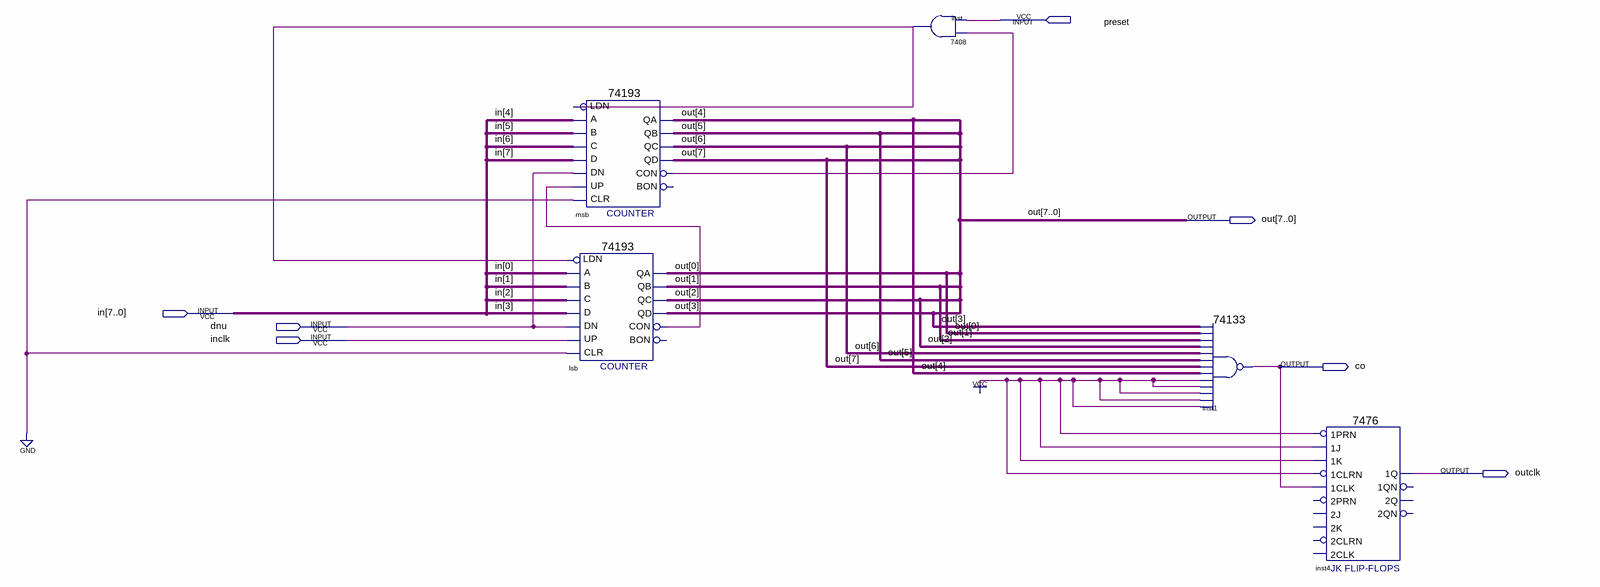
[diagram p0: schematic sheet]
// Quartus schematic FrequencyDivider.bdf as structural Verilog: 5 symbols, 7 pins
module FrequencyDivider (
  input  preset,
  input  [7:0] in,
  input  dnu,
  input  inclk,
  output [7:0] out,
  output co,
  output outclk
);

  wire inst_1, lsb_con, msb_con;

  \74193  msb (
    .D(in[7]), .C(in[6]), .B(in[5]), .A(in[4]), .CLR(1'b0), .UP(lsb_con), .DN(dnu), .LDN(inst_1),
    .QB(out[5]), .QA(out[4]), .CON(msb_con), .QD(out[7]), .QC(out[6]));  // open: BON
  \74193  lsb (
    .D(in[3]), .C(in[2]), .B(in[1]), .A(in[0]), .CLR(1'b0), .UP(inclk), .DN(dnu), .LDN(inst_1), .QB(out[1]),
    .QA(out[0]), .CON(lsb_con), .QD(out[3]), .QC(out[2]));  // open: BON
  \7408  inst (.\3 (preset), .\2 (msb_con), .\1 (inst_1));
  \74133  inst1 (
    .\13 (1'b1), .\12 (1'b1), .\11 (1'b1), .\10 (1'b1), .\9 (out[4]), .\7 (out[5]), .\8 (out[7]),
    .\6 (out[6]), .\2 (out[3]), .\3 (out[0]), .\14 (1'b1), .\5 (out[2]), .\4 (out[1]), .\1 (co));
  \7476  inst4 (
    .\1J (1'b1), .\1K (1'b1), .\1PRN (1'b1), .\1CLK (co), .\1CLRN (1'b1), .\1Q (outclk));  // open: 2PRN, 2J, 2K, 2CLRN, 2CLK, 2QN, 2Q, 1QN
endmodule
